# EAGLE design boost_phase (EAGLE 7.6.0)
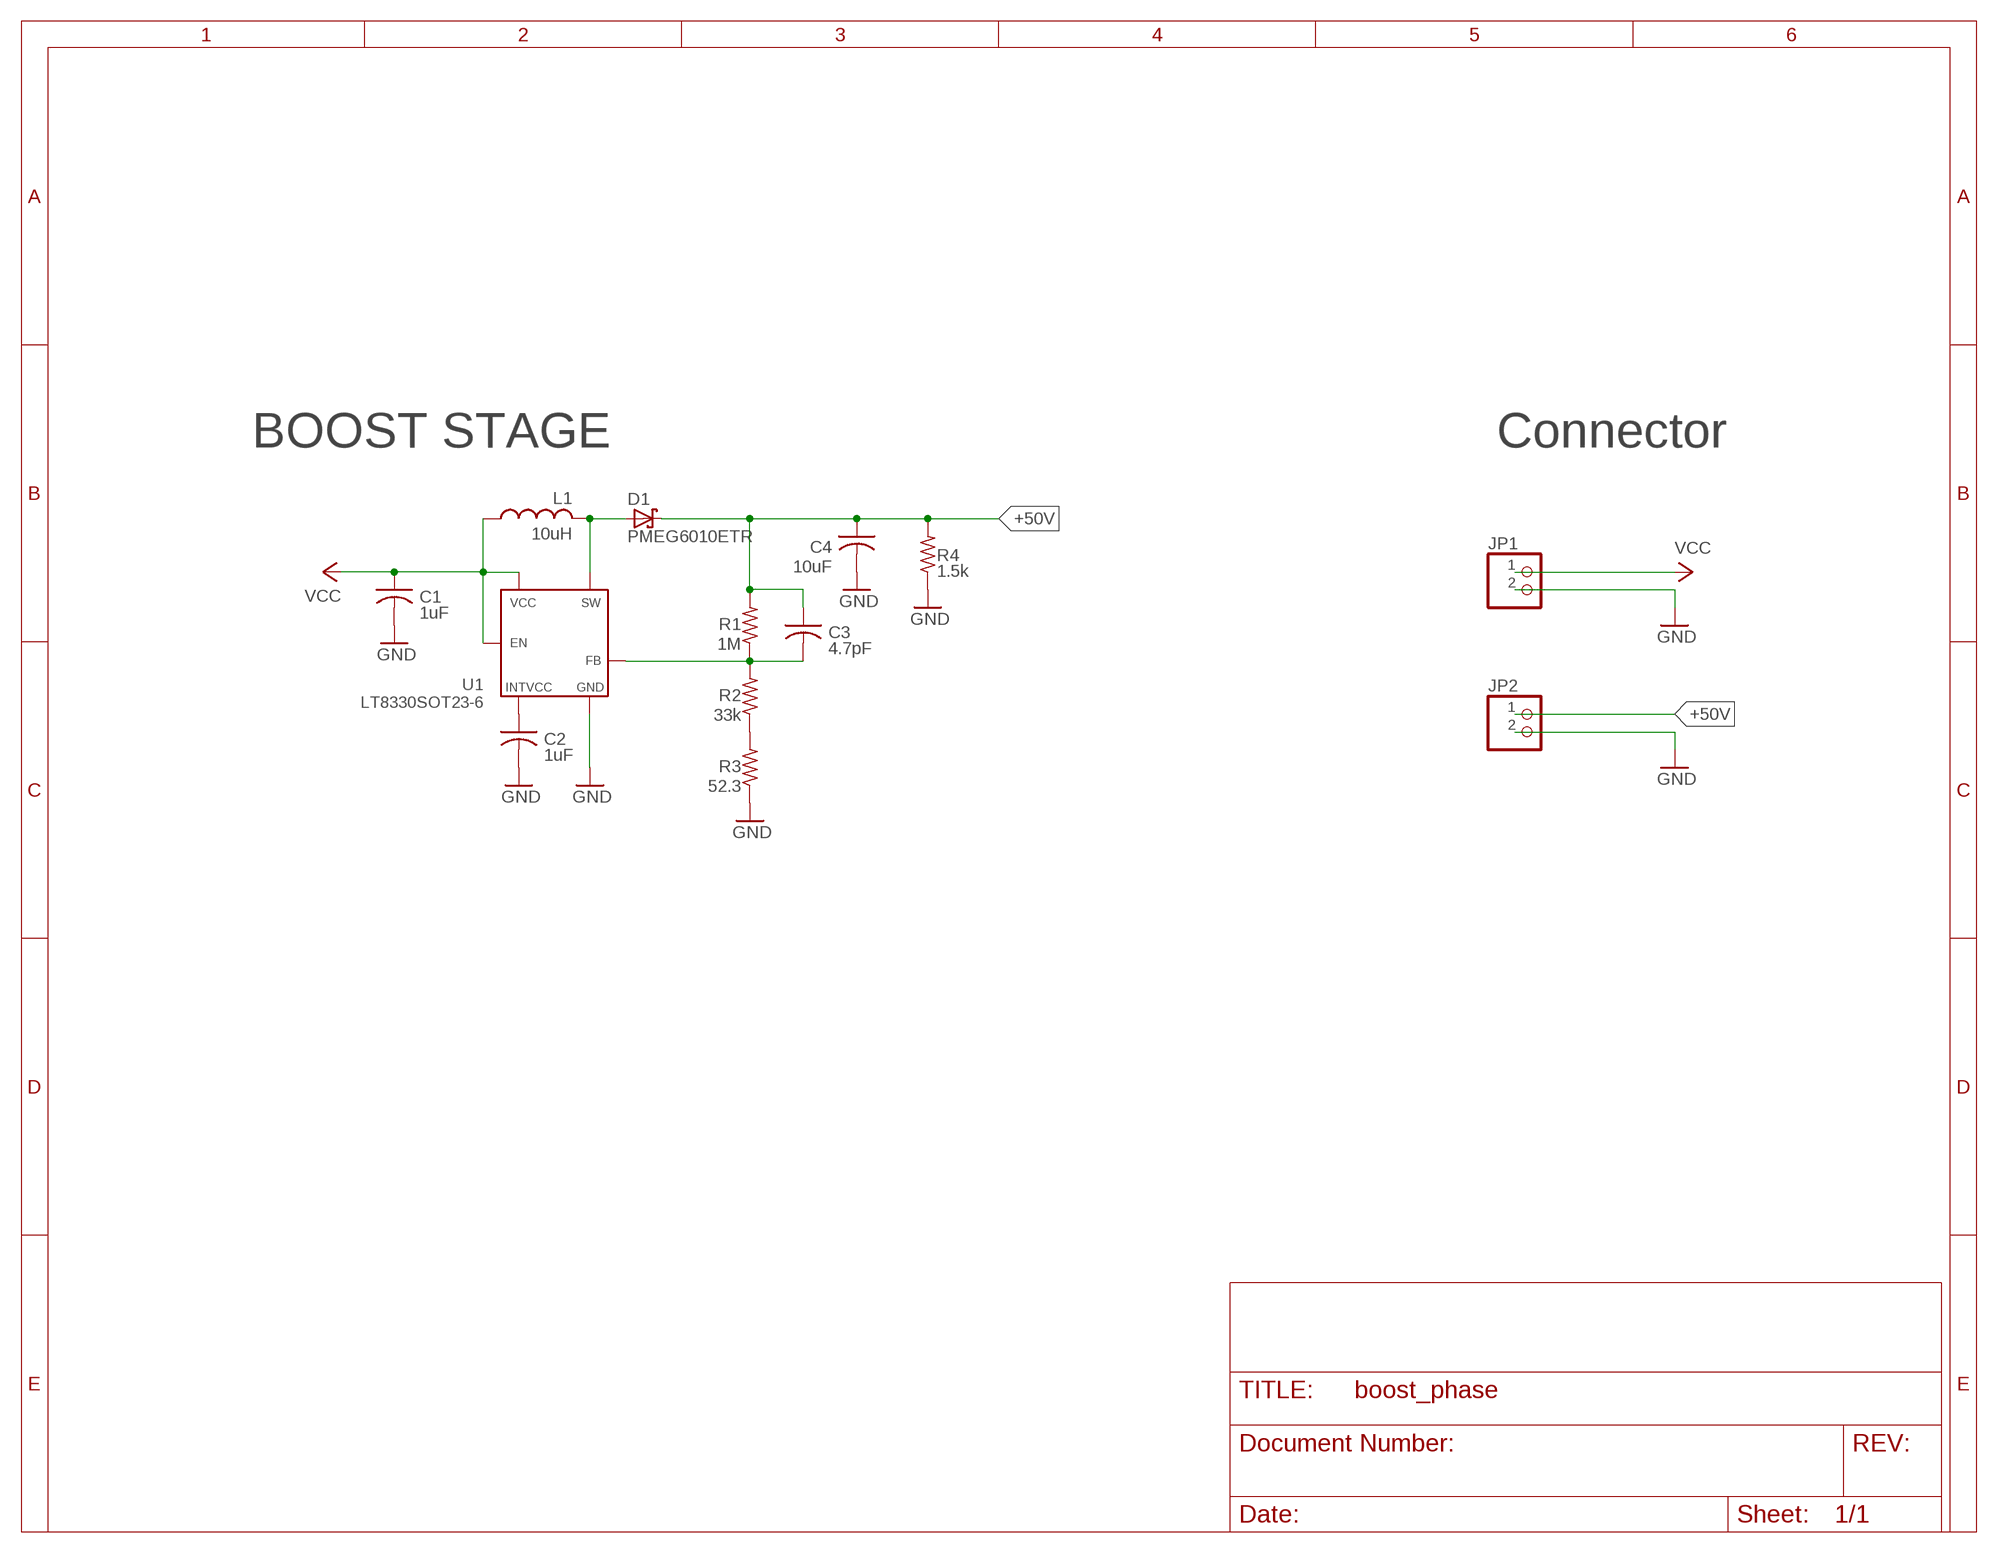
[diagram p0: schematic, sheet 1]

## Parts
C1  1uF  C-USC0805  [C0805]
C2  1uF  C-USC0805  [C0805]
C3  4.7pF  C-USC0805  [C0805]
C4  10uF  CAPACITOR2-J-LEAD  [2J-LEAD]
D1  PMEG6010ETR  SCHOTTKYSOD123  [SOD123]
JP1  SCREWTERM_1X2  [SCREWTERM_1X2]
JP2  SCREWTERM_1X2  [SCREWTERM_1X2]
L1  10uH  INDUCTORPQ2614  [PQ2614]
R1  1M  R-US_R0805  [R0805]
R2  33k  R-US_R0805  [R0805]
R3  52.3  R-US_R0805  [R0805]
R4  1.5k  R-US_R2512  [R2512]
U1  LT8330SOT23-6  [SOT23-6]

## Nets
+50V: C3.1 C4.P$1 D1.P$2(C) JP2.1 R1.2 R4.2
GND: C1.2 C2.2 C4.P$2 JP1.2 JP2.2 R3.1 R4.1 U1.2(GND)
N$1: C2.1 U1.5(INTVCC)
N$2: R2.1 R3.2
N$7: D1.P$1(A) L1.P$3 U1.1(SW)
N$9: C3.2 R1.1 R2.2 U1.3(FB)
VCC: C1.1 JP1.1 L1.P$2 U1.4(EN) U1.6(VCC)

## Notes on the sheet
- BOOST STAGE | Connector

## Library data of the parts
C1-C3 = resistor:C-US: CAPACITOR, American symbol
C4 = AR_passives:CAPACITOR
D1 = AR_diode:SCHOTTKY
JP1 JP2 = NR_Pinhead:SCREWTERM_1X2
L1 = AR_passives:INDUCTOR
R1-R4 = resistor:R-US_: RESISTOR, American symbol
U1 = AR_IC:LT8330

## Board
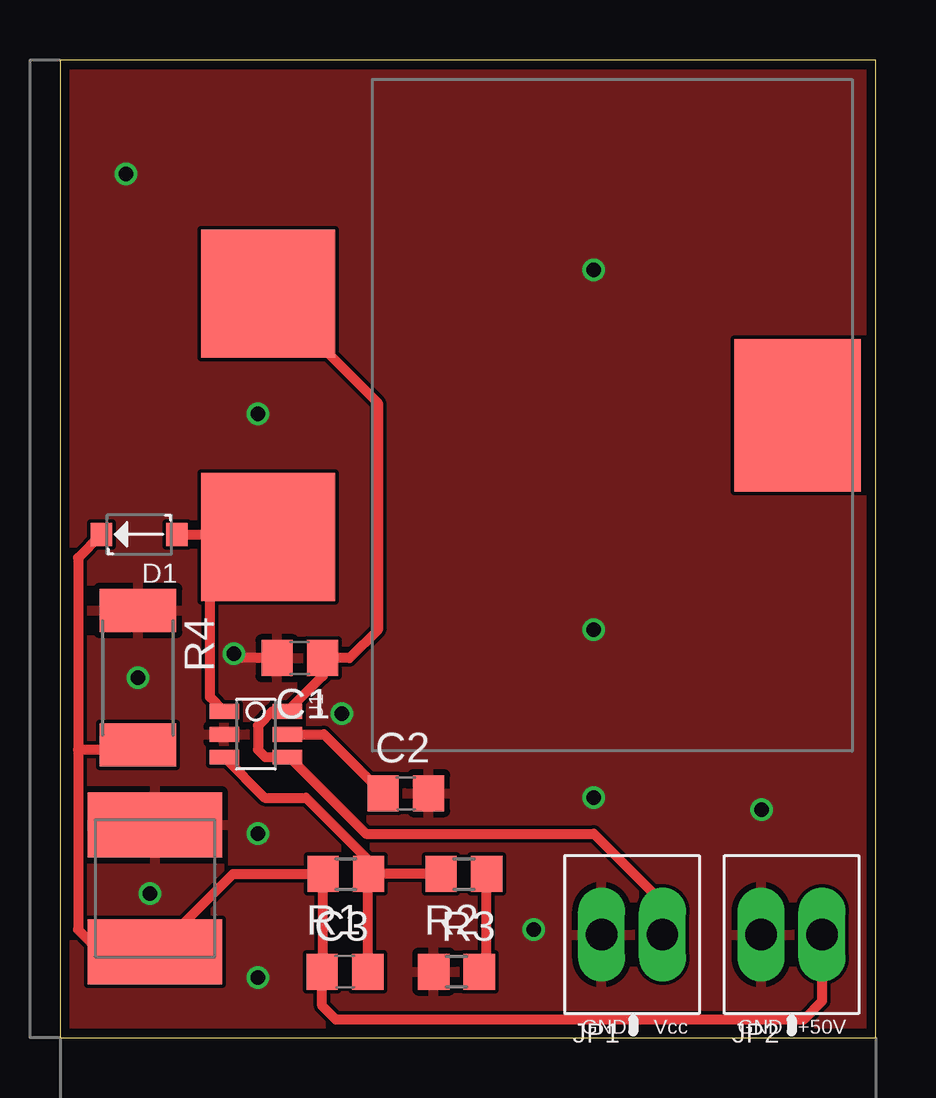
[diagram p1: board, top side]
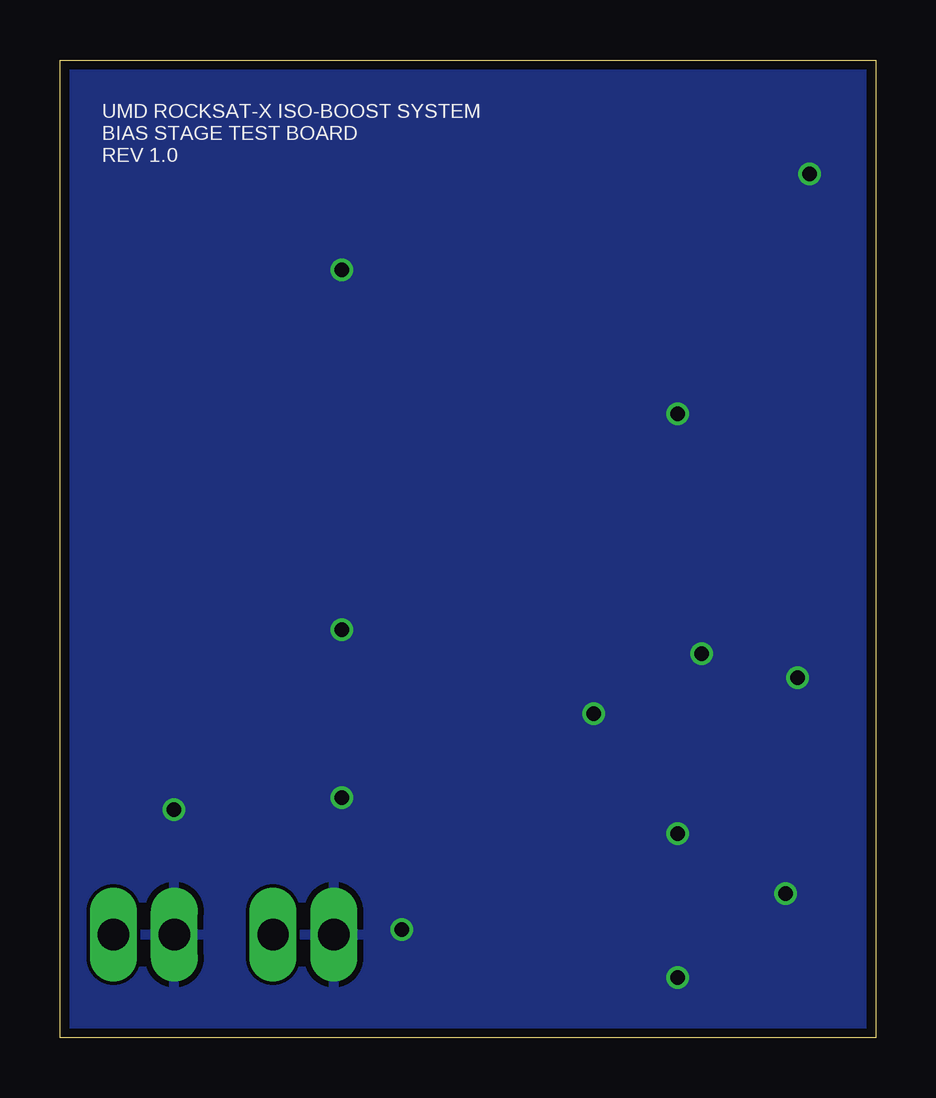
[diagram p2: board, bottom side, seen from below]

Size 34 x 40.75 mm. Coordinates in mm from the lower left corner, seen from the top.
Outline: 0,0 34,0 34,40.75 0,40.75 0,0
Copper layers (1*16): Top 0.0356mm / dielectric 1.5011mm / Bottom 0.0356mm
Design rules "oshpark-2layer": minimum track width 6mil, minimum drill 13mil, track to track 6mil, track to pad 6mil, pad to pad 6mil, via to via 6mil, smd to smd 6mil, copper to edge 15mil, drill to drill 6mil, minimum pad ring 7mil, minimum via ring 7mil, stop-mask expansion 2.5mil, vias tented up to drill 0mil, thermal gap 10mil

### Footprints (pad centres in the part's own frame; a part is rotated, then mirrored left to right if it is on the bottom)
C0805 = smd 1.3 x 1.5: 1 -0.95,0; 2 0.95,0
2J-LEAD = smd 2.7 x 5.6: P$1 -2.65,0; P$2 2.65,0
SOD123 = smd 0.9 x 0.95: P$1 -1.575,0; P$2 1.575,0
SCREWTERM_1X2 = drill 1.3 long: 1 1.27,0; 2 -1.27,0
PQ2614 = smd 6.35 x 5.28: P$1 0,7.72 | smd 5.33 x 5.59: P$2 -5.075,-14.355; P$3 5.075,-14.355
R0805 = smd 1.3 x 1.5: 1 -0.95,0; 2 0.95,0
R2512 = smd 1.8 x 3.2: 1 -2.8,0; 2 2.8,0
SOT23-6 = smd 0.62 x 1.23: 1 -0.95,-1.31; 2 0,-1.31; 3 0.95,-1.31; 4 0.95,1.31; 5 0,1.31; 6 -0.95,1.31

### Placement (x,y rotation side)
C1  10,15.82 180 top
C2  14.42,10.18 0 top
C3  11.88,2.75 0 top
C4  3.96,6.22 90 top
D1  3.3,20.97 180 top
JP1  23.85,4.29 0 top
JP2  30.5,4.29 0 top
L1  23.03,25.94 270 top
R1  11.92,6.82 180 top
R2  16.84,6.82 180 top
R3  16.53,2.75 0 top
R4  3.25,15 270 top
U1  8.16,12.64 270 top

### Tracks (layer width: path | path; a pad name or v marks a point on that pad's centre or on a via)
+50V
  Top 0.406: 0.75,12 0.75,20 D1.P$2 | 0.75,12 0.75,4.5 1.68,3.57 C4.P$1 7.21,6.82 R1.2 10.97,2.79 C3.1 10.93,1.32 11.5,0.75 31,0.75 31.77,1.52 JP2.1 | R4.2 3.05,12 0.75,12
GND  (via drill 0.6)
  Top 0.406: C1.2 7.43,15.82 v7.25,16 | 3.25,9.58 C4.P$2
  other vias: 3.25,15 2.75,36 22.25,32 8.25,26 22.25,17 29.25,9.5 22.25,10 8.25,2.5 3.75,6 8.25,8.5 11.75,13.5 19.75,4.5
  pour Bottom: -4,45 39,45 39,-6 -4,-6
  pour Top: -3.5,44 37.5,44 37.5,-4 -3.5,-4
N$1
  Top 0.406: U1.5 11.01,12.64 C2.1
N$2
  Top 0.406: R3.2 17.79,3.06 R2.1
N$7
  Top 0.406: D1.P$1 6.25,20.97 | 6.25,20.97 8.57,20.97 L1.P$3 | U1.1 6.25,14.19 6.25,20.97
N$9
  Top 0.406: U1.3 8.54,10 10.25,10 12.87,7.38 R1.1 | R2.2 R1.1 | R1.1 12.83,6.78 C3.2
VCC
  Top 0.406: L1.P$2 13.25,26.44 13.25,17 12.07,15.82 C1.1 10.95,15.07 U1.6 8.84,13.59 8.25,13 8.25,12 8.56,11.69 U1.4 9.56,11.69 12.75,8.5 22.25,8.5 25.12,5.63 JP1.1

### Text on the board
tPlace: GND | Vcc | GND | +50V
bPlace: UMD ROCKSAT-X ISO-BOOST SYSTEM / BIAS STAGE TEST BOARD / REV 1.0